# Altium schematic sheet QTR.SchDoc
size A4
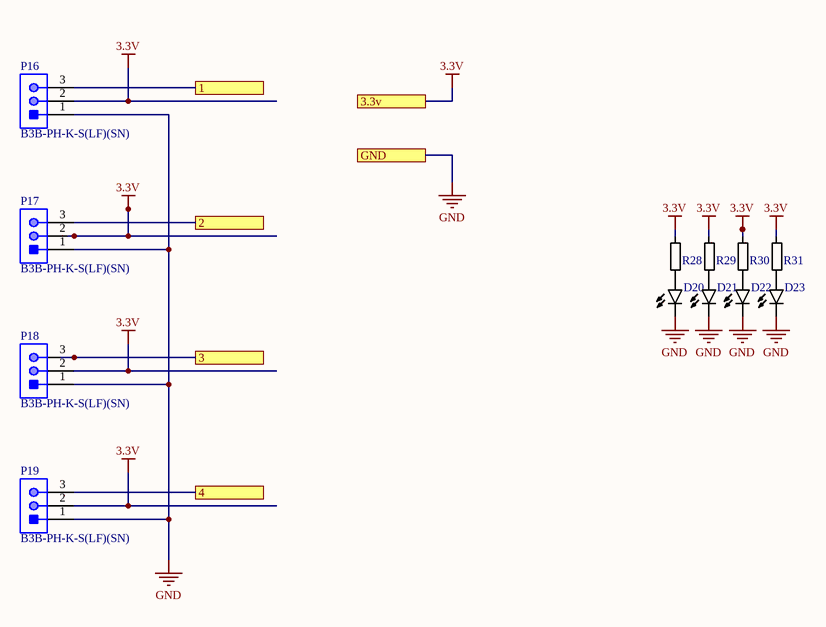
[diagram p0: QTR.SchDoc]

## Parts
D20  597-3305-607F  [0805 LED]  (value not drawn)
D21  597-3305-607F  [0805 LED]  (value not drawn)
D22  597-3305-607F  [0805 LED]  (value not drawn)
D23  597-3305-607F  [0805 LED]  (value not drawn)
P16  B3B-PH-K-S(LF)(SN)  [JST-B3B-PH-K-S-3_V]
P17  B3B-PH-K-S(LF)(SN)  [JST-B3B-PH-K-S-3_V]
P18  B3B-PH-K-S(LF)(SN)  [JST-B3B-PH-K-S-3_V]
P19  B3B-PH-K-S(LF)(SN)  [JST-B3B-PH-K-S-3_V]
R28  CR0805-JW-221ELF  [0805 res]  (value not drawn)
R29  CR0805-JW-221ELF  [0805 res]  (value not drawn)
R30  CR0805-JW-221ELF  [0805 res]  (value not drawn)
R31  CR0805-JW-221ELF  [0805 res]  (value not drawn)

## Ports
1, 2, 3, 3.3v, 4, GND

## Nets
3.3V: P16.2 P17.2 P18.2 P19.2 R28.1 R29.1 R30.1 R31.1 ; port 3.3v
GND: D20.C D21.C D22.C D23.C P16.1 P17.1 P18.1 P19.1 ; port GND
1: P16.3 ; port 1
2: P17.3 ; port 2
3: P18.3 ; port 3
4: P19.3 ; port 4
NetD20_A: D20.A R28.2
NetD21_A: D21.A R29.2
NetD22_A: D22.A R30.2
NetD23_A: D23.A R31.2

## Library data of the parts
D20-D23 = 597-3305-607F: LED Uni-Color Green 4-Pin Chip 0805 T/R; Availability: Unavailable; Value: *; Price: None; MP: 597-3305-607F; Package: None
P16-P19 = CMP-2000-05164-1: Male Header, Pitch 2 mm, 1 x 3 Position, Height 6 mm, Tail Length 3.4 mm, -25 to 85 degC, RoHS, Bulk; Manufacturer: JST; Style/Orientation: StraightHeader/Plug; Pitch: 2mm; No of Positions: 3; Termination: Crimp; Manufacturer URL: http://www.jst.com/home2.html; Datasheet Version: Oct-06; Type: ShroudedHeader; Datasheet URL: https://datasheet.ciiva.com/11746/0900766b80826550-11746939.pdf
R28-R31 = CR0805-JW-221ELF: 220 Ohms Â±5% 0.125W, 1/8W Chip Resistor 0805 (2012 Metric) Moisture Resistant Thick Film; MF: Bourns; Value: *; Check_prices: https://www.snapeda.com/parts/CR0805-JW-221ELF/Bourns/view-part/?ref=eda; MP: CR0805-JW-221ELF; Price: None; Package: 2012 Bourns; Availability: In Stock; SnapEDA_Link: https://www.snapeda.com/parts/CR0805-JW-221ELF/Bourns/view-part/?ref=snap; Purchase-URL: https://pricing.snapeda.com/search/part/CR0805-JW-221ELF/?ref=eda